# EAGLE schematic arm_new (EAGLE 7.5.0)
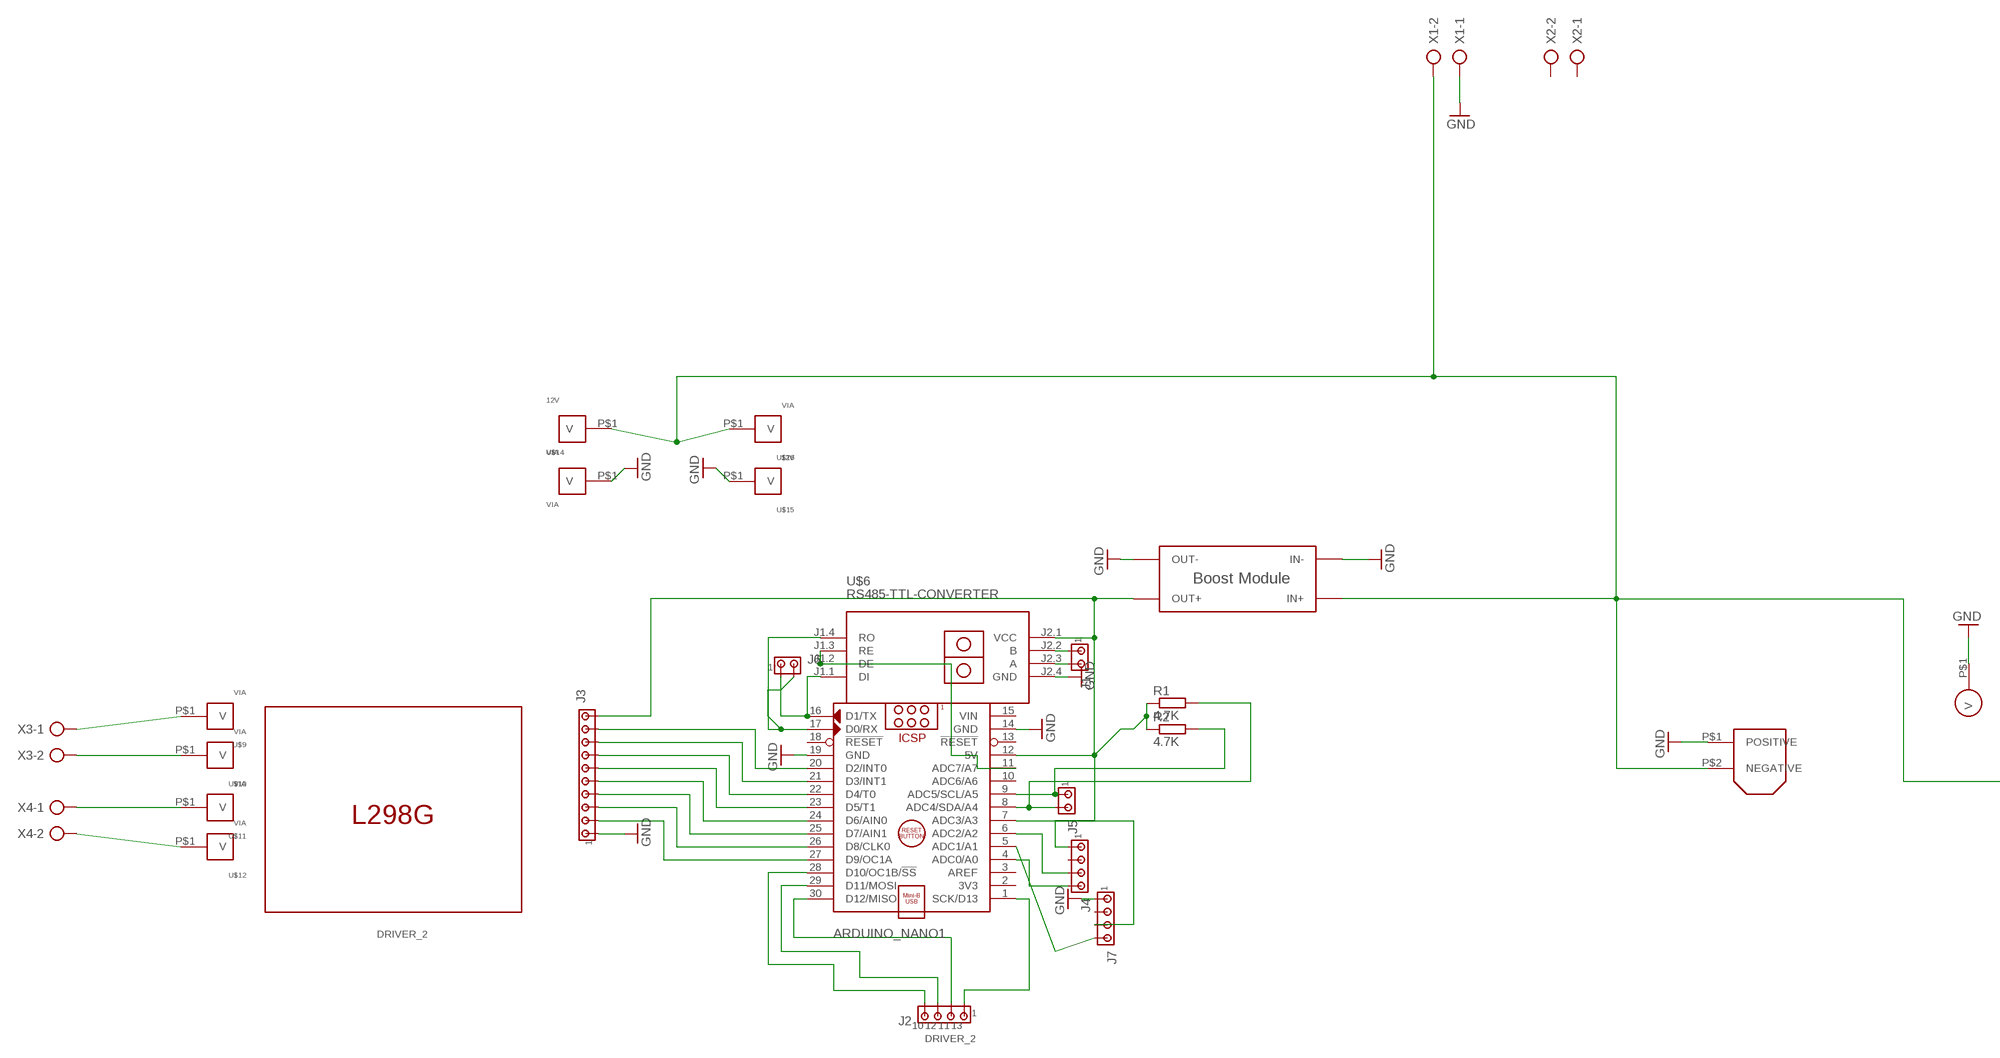
[diagram p0: schematic, sheet 1, part 1 of 2]
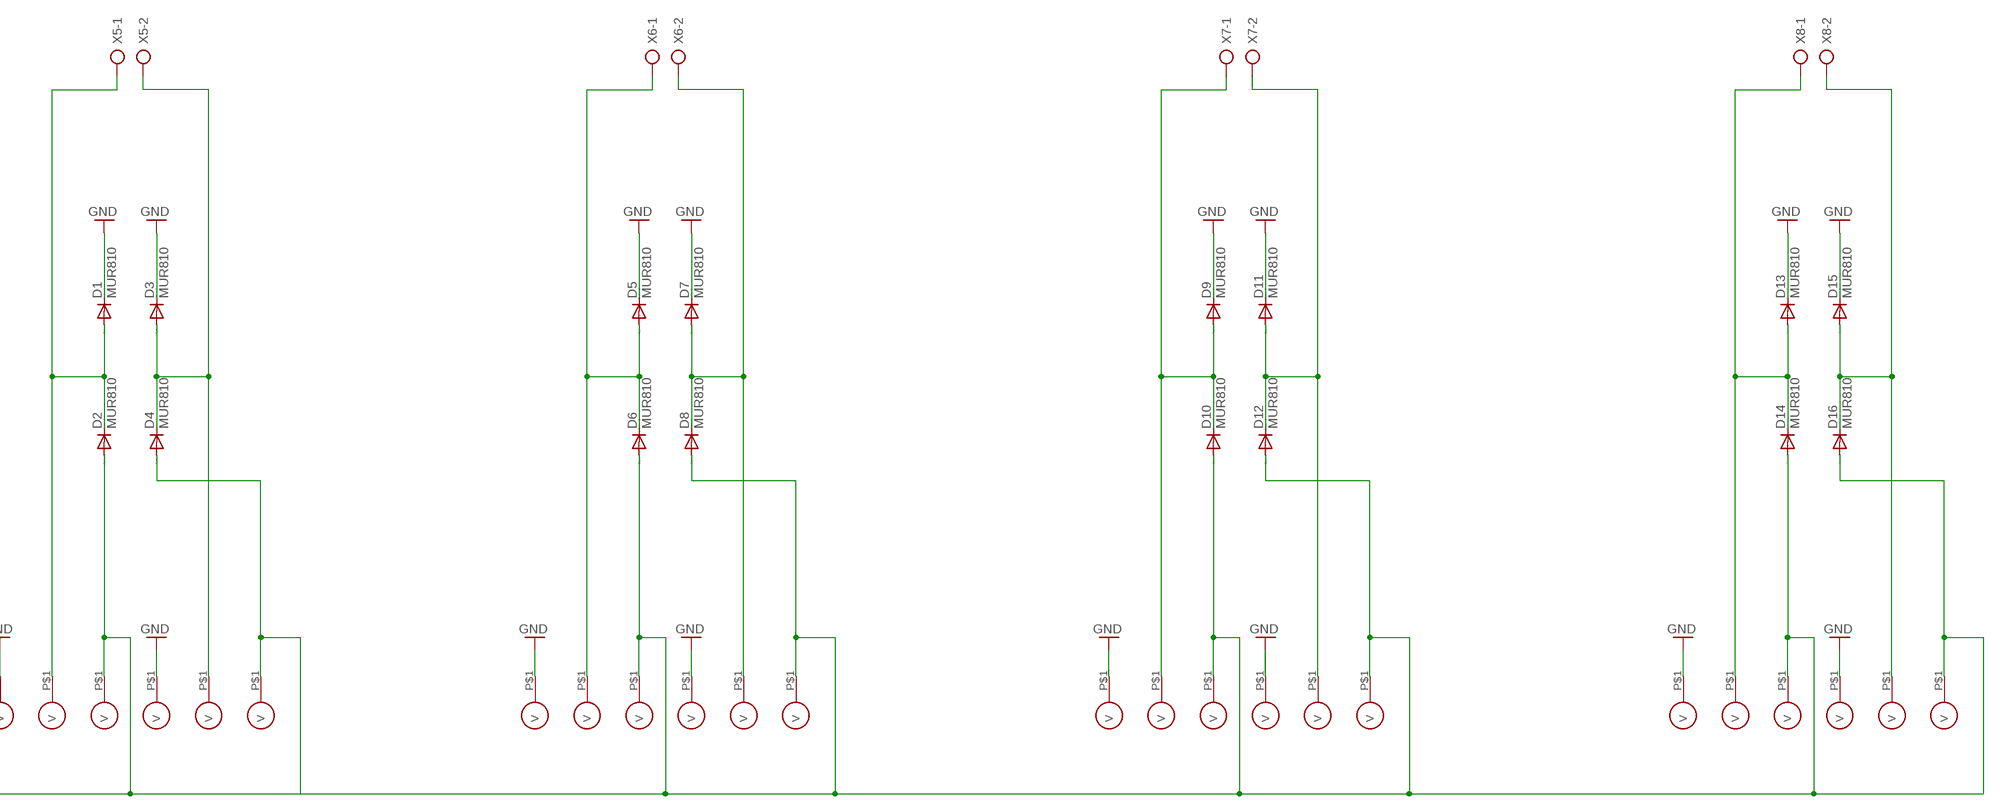
[diagram p1: schematic, sheet 1, part 2 of 2]

## Parts
12V  VIA  [VIA]
ARDUINO_NANO1  ARDUINO_NANO  [ARDUINO_NANO]
D1  MUR810  [TO220ACS]
D2  MUR810  [TO220ACS]
D3  MUR810  [TO220ACS]
D4  MUR810  [TO220ACS]
D5  MUR810  [TO220ACS]
D6  MUR810  [TO220ACS]
D7  MUR810  [TO220ACS]
D8  MUR810  [TO220ACS]
D9  MUR810  [TO220ACS]
D10  MUR810  [TO220ACS]
D11  MUR810  [TO220ACS]
D12  MUR810  [TO220ACS]
D13  MUR810  [TO220ACS]
D14  MUR810  [TO220ACS]
D15  MUR810  [TO220ACS]
D16  MUR810  [TO220ACS]
J1  MTA02-100  [10X02MTA]
J2  MTA04-100  [10X04MTA]
J3  MTA10-100  [10X10MTA]
J4  MTA04-100  [10X04MTA]
J5  MTA02-100  [10X02MTA]
J6  MTA02-100  [10X02MTA]
J7  MTA04-100  [10X04MTA]
NO  NO  ROUND_VIA  [ROUND_VIA]
NO1  NO  ROUND_VIA  [ROUND_VIA]
NO2  NO  ROUND_VIA  [ROUND_VIA]
NO3  NO  ROUND_VIA  [ROUND_VIA]
R1  4.7K  R-EU_0204/7  [0204/7]
R2  4.7K  R-EU_0204/7  [0204/7]
U$1  BOOST_MODULE  [BOOST_MODULE]
U$2  XT60  [CONNECTOR]
U$4  L298G  [L298G]
U$6  RS485-TTL-CONVERTER  [RS485-TTL-CONVERTER]
U$9  VIA  [VIA]
U$10  VIA  [VIA]
U$11  VIA  [VIA]
U$12  VIA  [VIA]
U$14  VIA  [VIA]
U$15  12V  VIA  [VIA]
U$16  VIA  [VIA]
U$17  ROUND_VIA  [ROUND_VIA]
U$18  ROUND_VIA  [ROUND_VIA]
U$19  ROUND_VIA  [ROUND_VIA]
U$20  ROUND_VIA  [ROUND_VIA]
U$21  ROUND_VIA  [ROUND_VIA]
U$22  ROUND_VIA  [ROUND_VIA]
U$23  ROUND_VIA  [ROUND_VIA]
U$24  ROUND_VIA  [ROUND_VIA]
U$25  ROUND_VIA  [ROUND_VIA]
U$26  ROUND_VIA  [ROUND_VIA]
U$27  ROUND_VIA  [ROUND_VIA]
U$28  ROUND_VIA  [ROUND_VIA]
U$29  ROUND_VIA  [ROUND_VIA]
U$30  ROUND_VIA  [ROUND_VIA]
U$31  ROUND_VIA  [ROUND_VIA]
U$32  ROUND_VIA  [ROUND_VIA]
U$33  ROUND_VIA  [ROUND_VIA]
U$34  ROUND_VIA  [ROUND_VIA]
U$35  ROUND_VIA  [ROUND_VIA]
U$36  ROUND_VIA  [ROUND_VIA]
X1  AK300/2  [AK300/2]
X2  AK300/2  [AK300/2]
X3  AK300/2  [AK300/2]
X4  AK300/2  [AK300/2]
X5  AK300/2  [AK300/2]
X6  AK300/2  [AK300/2]
X7  AK300/2  [AK300/2]
X8  AK300/2  [AK300/2]

## Nets
5V: ARDUINO_NANO1.12(5V) J3.10 J4.1 R1.1 R2.1 U$1.OUT+ U$6.J2.1(VCC)
GND: ARDUINO_NANO1.14(GND) ARDUINO_NANO1.19(GND) D1.C D3.C D5.C D7.C D9.C D11.C D13.C D15.C J3.1 J7.1 NO1.P$1(V) NO2.P$1(V) NO3.P$1(V) NO.P$1(V) U$1.IN- U$1.OUT- U$2.P$1(POSITIVE) U$6.J2.4(GND) U$14.P$1(V) U$15.P$1(V) U$20.P$1(V) U$24.P$1(V) U$29.P$1(V) U$34.P$1(V) X1.1
N$1: ARDUINO_NANO1.6(ADC2/A2) J4.3
N$2: ARDUINO_NANO1.4(ADC0/A0) J4.4
N$3: ARDUINO_NANO1.7(ADC3/A3) J7.3
N$4: ARDUINO_NANO1.5(ADC1/A1) J7.4
N$5: U$9.P$1(V) X3.1
N$6: U$10.P$1(V) X3.2
N$7: U$11.P$1(V) X4.1
N$8: U$12.P$1(V) X4.2
N$9: ARDUINO_NANO1.1(SCK/D13) J2.1
N$10: D1.A D2.C U$18.P$1(V) X5.1
N$11: ARDUINO_NANO1.30(D12/MISO) J2.2
N$12: ARDUINO_NANO1.20(D2/INT0) J3.9
N$13: ARDUINO_NANO1.29(D11/MOSI) J2.3
N$14: ARDUINO_NANO1.28(D10/OC1B/!SS) J2.4
N$15: ARDUINO_NANO1.21(D3/INT1) J3.8
N$16: ARDUINO_NANO1.22(D4/T0) J3.7
N$18: D5.A D6.C U$17.P$1(V) X6.1
N$19: ARDUINO_NANO1.23(D5/T1) J3.6
N$20: ARDUINO_NANO1.24(D6/AIN0) J3.5
N$21: ARDUINO_NANO1.25(D7/AIN1) J3.4
N$22: ARDUINO_NANO1.26(D8/CLK0) J3.3
N$23: ARDUINO_NANO1.27(D9/OC1A) J3.2
N$24: ARDUINO_NANO1.16(D1/TX) J6.1 U$6.J1.1(DI)
N$25: J1.1 U$6.J2.2(B)
N$26: ARDUINO_NANO1.9(ADC5/SCL/A5) J5.1 R2.2
N$27: ARDUINO_NANO1.8(ADC4/SDA/A4) J5.2 R1.2
N$31: D9.A D10.C U$27.P$1(V) X7.1
N$32: D3.A D4.C U$21.P$1(V) X5.2
N$34: D7.A D8.C U$25.P$1(V) X6.2
N$35: D13.A D14.C U$32.P$1(V) X8.1
N$37: D11.A D12.C U$30.P$1(V) X7.2
N$39: 12V.P$1(V) D2.A D4.A D6.A D8.A D10.A D12.A D14.A D16.A U$1.IN+ U$2.P$2(NEGATIVE) U$16.P$1(V) U$19.P$1(V) U$22.P$1(V) U$23.P$1(V) U$26.P$1(V) U$28.P$1(V) U$31.P$1(V) U$33.P$1(V) U$36.P$1(V) X1.2
N$42: D15.A D16.C U$35.P$1(V) X8.2
N$47: ARDUINO_NANO1.17(D0/RX) J6.2 U$6.J1.4(RO)
N$48: ARDUINO_NANO1.11(ADC7/A7) U$6.J1.2(DE) U$6.J1.3(RE)
N$49: J1.2 U$6.J2.3(A)
Unconnected: ARDUINO_NANO1.2(3V3) ARDUINO_NANO1.3(AREF) ARDUINO_NANO1.10(ADC6/A6) ARDUINO_NANO1.13(!RESET) ARDUINO_NANO1.18(!RESET) J4.2 J7.2 X2.1 X2.2

## Notes on the sheet
- DRIVER_2
- 10 | 12 | 11 | 13
- DRIVER_2

## Power pins joined to a net without a drawn wire
VIN: ARDUINO_NANO1.15(VIN)

## Library data of the parts
12V U$9-U$12 U$14-U$16 = via:VIA
ARDUINO_NANO1 = ArduinoNanoV30:ARDUINO_NANO: Arduino Nano V3.0 Module Overview: The Arduino Nano is a small, complete, and breadboard-friendly board based on the ATmega328 (Arduino Nano 3.x) or ATmega168 (Arduino Nano 2.x). It has more or less the same functionality of the Arduino Duemilanove, but in a different package. It lacks only a DC power jack, and works with a Mini-B USB cable instead of a standard one. The Nano was designed and is being produced by Gravitech <http://www.gravitech.us/arna30wiatp.html>. General specifications: Item Value Microcontroller Atmel ATmega168 or ATmega328 Operating Voltage (logic level) 5 V Input Voltage (recommended) 7-12 V Input Voltage (limits) 6-20 V Digital I/O Pins 14 (of which 6 provide PWM output) Analog Input Pins 8 DC Current per I/O Pin 40 mA Flash Memory 16 KB (ATmega168) or 32 KB (ATmega328) of which 2 KB used by bootloader SRAM 1 KB (ATmega168) or 2 KB (ATmega328) EEPROM 512 bytes (ATmega168) or 1 KB (ATmega328) Clock Speed 16 MHz Dimensions (Inches) 0.73" x 1.70" Dimensions (mm) 18mm x 45mm Overall height About 9 mm (not including pins) Weigth 5 g Power: The Arduino Nano can be powered via the Mini-B USB connection, 6-20V unregulated external power supply (pin 30), or 5V regulated external power supply (pin 27). The power source is automatically selected to the highest voltage source. Memory: The ATmega168 has 16 KB of flash memory for storing code (of which 2 KB is used for the bootloader); the ATmega328 has 32 KB, (also with 2 KB used for the bootloader). The ATmega168 has 1 KB of SRAM and 512 bytes of EEPROM (which can be read and written with the EEPROM library); the ATmega328 has 2 KB of SRAM and 1 KB of EEPROM. Input and Output: Each of the 14 digital pins on the Nano can be used as an input or output, using pinMode(), digitalWrite(), and digitalRead() functions. They operate at 5 volts. Each pin can provide or receive a maximum of 40 mA and has an internal pull-up resistor (disconnected by default) of 20-50 kOhms. In addition, some pins have specialized functions. Visit Arduino - ArduinoBoardNano <https://www.arduino.cc/en/Main/ArduinoBoardNano>
D1-D16 = diode:MUR810: DIODE
J1 J5 J6 = con-amp:MTA02-100: AMP connector
J2 J4 J7 = con-amp:MTA04-100: AMP connector
J3 = con-amp:MTA10-100: AMP connector
NO NO1-NO3 U$17-U$36 = round_via:ROUND_VIA
R1 R2 = rcl:R-EU_: RESISTOR, European symbol
U$1 = Boost Module:BOOST_MODULE
U$2 = xt60_V2:XT60
U$4 = motor_driver:L298G
U$6 = diy-modules:RS485-TTL-CONVERTER: RS485 to TTL converter based on MAX485 chip
X1-X8 = con-ptr500:AK300/2: CONNECTOR; OC_FARNELL: unknown; OC_NEWARK: unknown